# EAGLE schematic schema (EAGLE 7.7.0)
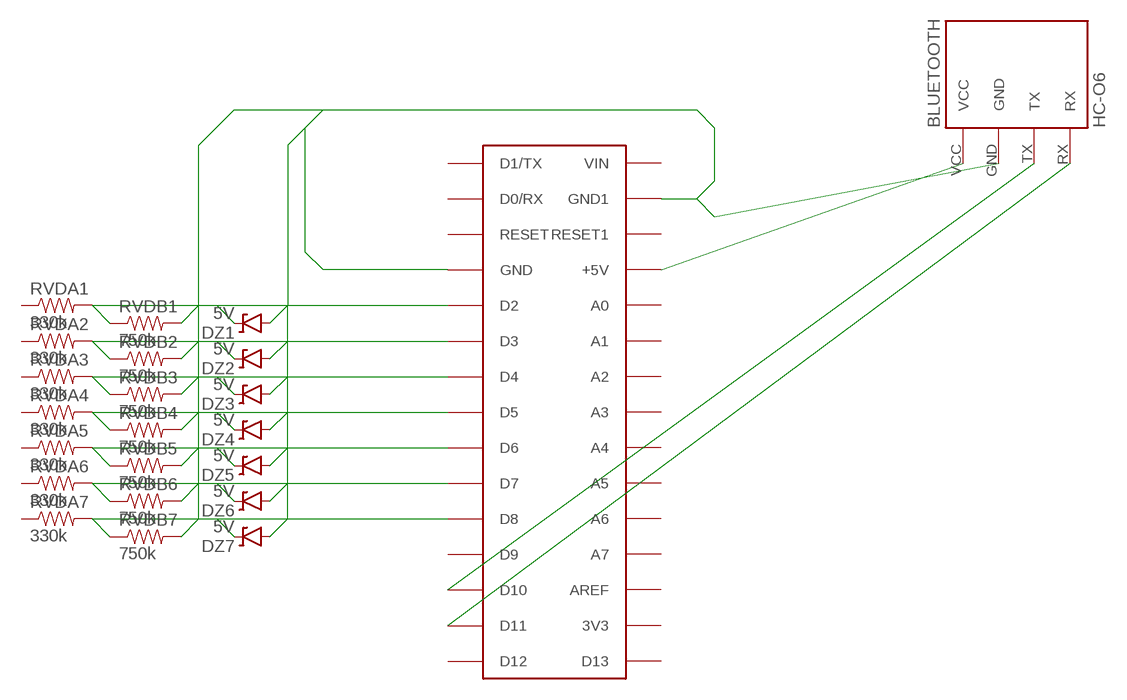
[diagram p0: schematic, sheet 1]

## Parts
BLUETOOTH  HC-O6  BLUETOOTH_BOARDSTANDING  [BT_BOARD_FOOTPRINT_STANDING]
DZ1  5V  DIODE-ZENER16V  [SOD-123]
DZ2  5V  DIODE-ZENER16V  [SOD-123]
DZ3  5V  DIODE-ZENER16V  [SOD-123]
DZ4  5V  DIODE-ZENER16V  [SOD-123]
DZ5  5V  DIODE-ZENER16V  [SOD-123]
DZ6  5V  DIODE-ZENER16V  [SOD-123]
DZ7  5V  DIODE-ZENER16V  [SOD-123]
RVDA1  330k  0.11OHM1/2W1%(2010)  [R2010]
RVDA2  330k  0.11OHM1/2W1%(2010)  [R2010]
RVDA3  330k  0.11OHM1/2W1%(2010)  [R2010]
RVDA4  330k  0.11OHM1/2W1%(2010)  [R2010]
RVDA5  330k  0.11OHM1/2W1%(2010)  [R2010]
RVDA6  330k  0.11OHM1/2W1%(2010)  [R2010]
RVDA7  330k  0.11OHM1/2W1%(2010)  [R2010]
RVDB1  750k  0.11OHM1/2W1%(2010)  [R2010]
RVDB2  750k  0.11OHM1/2W1%(2010)  [R2010]
RVDB3  750k  0.11OHM1/2W1%(2010)  [R2010]
RVDB4  750k  0.11OHM1/2W1%(2010)  [R2010]
RVDB5  750k  0.11OHM1/2W1%(2010)  [R2010]
RVDB6  750k  0.11OHM1/2W1%(2010)  [R2010]
RVDB7  750k  0.11OHM1/2W1%(2010)  [R2010]
U$1  NANO  ARDUINONANO  [PDIP-32]

## Nets
ARDUINO: BLUETOOTH.GND DZ1.A DZ2.A DZ3.A DZ4.A DZ5.A DZ6.A DZ7.A RVDB1.2 RVDB2.2 RVDB3.2 RVDB4.2 RVDB5.2 RVDB6.2 RVDB7.2 U$1.GND U$1.GND1
N$1: BLUETOOTH.VCC U$1.+5V
N$2: DZ1.C RVDA1.2 RVDB1.1 U$1.D2
N$3: BLUETOOTH.TX U$1.D10
N$4: BLUETOOTH.RX U$1.D11
N$5: DZ2.C RVDA2.2 RVDB2.1 U$1.D3
N$6: DZ3.C RVDA3.2 RVDB3.1 U$1.D4
N$7: DZ4.C RVDA4.2 RVDB4.1 U$1.D5
N$8: DZ5.C RVDA5.2 RVDB5.1 U$1.D6
N$9: DZ6.C RVDA6.2 RVDB6.1 U$1.D7
N$10: DZ7.C RVDA7.2 RVDB7.1 U$1.D8
Unconnected: RVDA1.1 RVDA2.1 RVDA3.1 RVDA4.1 RVDA5.1 RVDA6.1 RVDA7.1 U$1.3V3 U$1.A0 U$1.A1 U$1.A2 U$1.A3 U$1.A4 U$1.A5 U$1.A6 U$1.A7 U$1.AREF U$1.D0/RX U$1.D1/TX U$1.D9 U$1.D12 U$1.D13 U$1.RESET U$1.RESET1 U$1.VIN

## Library data of the parts
BLUETOOTH = Bluetooth HC-05:BLUETOOTH_BOARD: Bluetooth Board V1.05
DZ1-DZ7 = SparkFun-DiscreteSemi:DIODE-ZENER: Zener Diode Production Part - 8199 3.4V Zener Voltage; PROD_ID: DIO-12440; VALUE: 16V
RVDA1-RVDA7 RVDB1-RVDB7 = SparkFun-Resistors:0.11OHM1/2W1%(2010): RES-08354; PROD_ID: RES-08354
U$1 = jet-lib:ARDUINONANO; MPN: A000005; OC_NEWARK: 13T9275

## Module OBDII
Ports: 

### Library data of the parts

## Net classes
0 default: width 0.61 mm